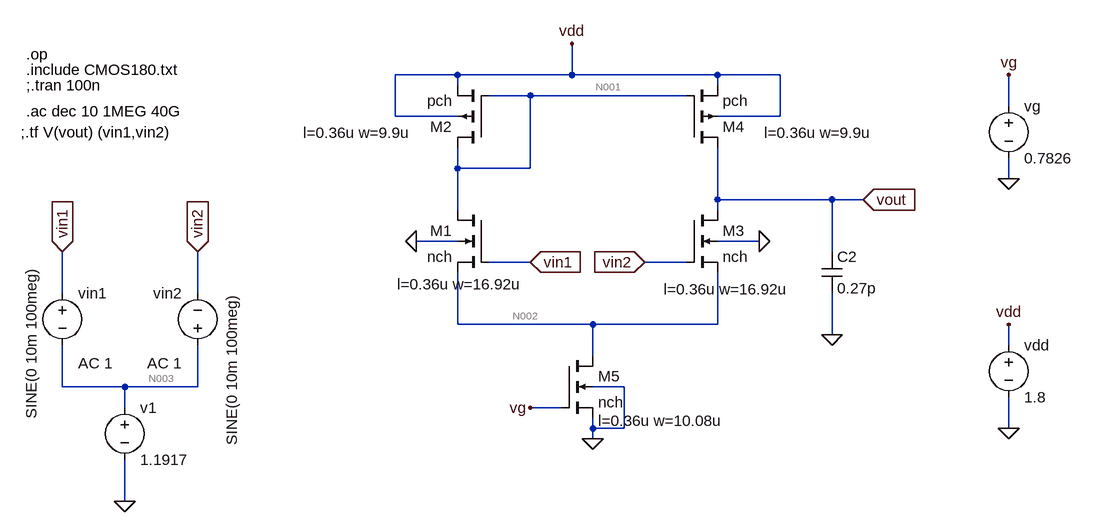
[diagram p0: schematic single stage opmap.asc]
single stage opmap.asc, the LTspice schematic file:
Version 4
SHEET 1 1088 756
WIRE -16 48 -112 48
WIRE 160 48 160 0
WIRE 160 48 -16 48
WIRE 384 48 160 48
WIRE 480 48 384 48
WIRE -16 64 -16 48
WIRE 384 64 384 48
WIRE 96 80 32 80
WIRE 336 80 96 80
WIRE 832 96 832 48
WIRE -112 112 -112 48
WIRE -16 112 -112 112
WIRE 480 112 480 48
WIRE 480 112 384 112
WIRE -16 192 -16 160
WIRE 96 192 96 80
WIRE 96 192 -16 192
WIRE 832 208 832 176
WIRE 384 240 384 160
WIRE 560 240 384 240
WIRE 608 240 560 240
WIRE -16 256 -16 192
WIRE 384 256 384 240
WIRE -16 304 -80 304
WIRE 448 304 384 304
WIRE 560 320 560 240
WIRE 96 336 32 336
WIRE 336 336 272 336
WIRE -624 384 -624 320
WIRE -416 384 -416 320
WIRE -16 432 -16 352
WIRE 192 432 -16 432
WIRE 384 432 384 352
WIRE 384 432 192 432
WIRE 560 448 560 384
WIRE 832 464 832 432
WIRE 192 480 192 432
WIRE -624 528 -624 464
WIRE -528 528 -624 528
WIRE -416 528 -416 464
WIRE -416 528 -528 528
WIRE 240 528 192 528
WIRE -528 560 -528 528
WIRE 144 560 96 560
WIRE 192 592 192 576
WIRE 240 592 240 528
WIRE 240 592 192 592
WIRE 832 592 832 544
WIRE 192 608 192 592
WIRE -528 704 -528 640
FLAG 160 0 vdd
FLAG 608 240 vout
IOPIN 608 240 In
FLAG 560 448 0
FLAG -528 704 0
FLAG -624 320 vin1
IOPIN -624 320 In
FLAG -416 320 vin2
IOPIN -416 320 In
FLAG 96 336 vin1
IOPIN 96 336 In
FLAG 272 336 vin2
IOPIN 272 336 In
FLAG 832 432 vdd
FLAG 832 592 0
FLAG 448 304 0
FLAG 192 608 0
FLAG 96 560 vg
FLAG 832 208 0
FLAG 832 48 vg
FLAG -80 304 0
DATAFLAG 384 240 ""
SYMBOL nmos4 32 256 M0
WINDOW 123 -52 114 Left 2
SYMATTR Value2 l=0.36u w=16.92u
SYMATTR InstName M1
SYMATTR Value nch
SYMBOL pmos4 32 160 R180
WINDOW 123 120 23 Left 2
SYMATTR Value2 l=0.36u w=9.9u
SYMATTR InstName M2
SYMATTR Value pch
SYMBOL nmos4 336 256 R0
WINDOW 123 -35 122 Left 2
SYMATTR Value2 l=0.36u w=16.92u
SYMATTR InstName M3
SYMATTR Value nch
SYMBOL cap 544 320 R0
SYMATTR InstName C2
SYMATTR Value 0.27p
SYMBOL pmos4 336 160 M180
WINDOW 123 120 23 Left 2
SYMATTR Value2 l=0.36u w=9.9u
SYMATTR InstName M4
SYMATTR Value pch
SYMBOL voltage -528 544 R0
WINDOW 123 0 0 Left 0
WINDOW 39 0 0 Left 0
SYMATTR InstName v1
SYMATTR Value 1.1917
SYMBOL voltage -624 368 R0
WINDOW 3 -48 -25 VRight 2
WINDOW 123 24 124 Left 2
WINDOW 39 0 0 Left 0
SYMATTR Value SINE(0 10m 100meg)
SYMATTR Value2 AC 1
SYMATTR InstName vin1
SYMBOL voltage -416 480 R180
WINDOW 0 24 96 Left 2
WINDOW 3 -53 -138 VRight 2
WINDOW 123 24 -12 Left 2
WINDOW 39 0 0 Left 0
SYMATTR InstName vin2
SYMATTR Value SINE(0 10m 100meg)
SYMATTR Value2 AC 1
SYMBOL voltage 832 448 R0
WINDOW 123 0 0 Left 0
WINDOW 39 0 0 Left 0
SYMATTR InstName vdd
SYMATTR Value 1.8
SYMBOL nmos4 144 480 R0
WINDOW 123 56 100 Left 2
SYMATTR Value2 l=0.36u w=10.08u
SYMATTR InstName M5
SYMATTR Value nch
SYMBOL voltage 832 80 R0
WINDOW 123 0 0 Left 0
WINDOW 39 0 0 Left 0
SYMATTR InstName vg
SYMATTR Value 0.7826
TEXT -680 40 Left 2 !.include CMOS180.txt
TEXT -680 16 Left 2 !.op
TEXT -688 136 Left 2 !;.tf V(vout) (vin1,vin2)
TEXT -680 64 Left 2 !;.tran 100n
TEXT -680 104 Left 2 !.ac dec 10 1MEG 40G

The netlist it stands for:
* single stage opmap.asc
M1 N001 vin1 N002 0 nch l=0.36u w=16.92u
M2 N001 N001 vdd vdd pch l=0.36u w=9.9u
M3 vout vin2 N002 0 nch l=0.36u w=16.92u
C2 vout 0 0.27p
M4 vout N001 vdd vdd pch l=0.36u w=9.9u
v1 N003 0 1.1917
vin1 vin1 N003 SINE(0 10m 100meg) AC 1
vin2 N003 vin2 SINE(0 10m 100meg) AC 1
vdd vdd 0 1.8
M5 N002 vg 0 0 nch l=0.36u w=10.08u
vg vg 0 0.7826
.model NMOS NMOS
.model PMOS PMOS
.lib standard.mos
.include CMOS180.txt
.op
;.tf V(vout) (vin1,vin2)
;.tran 100n
.ac dec 10 1MEG 40G
.backanno
.end

* Results of the author's LTspice run, read from the files saved beside the schematic
* Operating Point, zero values left out:
*   V(n001) = 928.7 mV
*   V(vin1) = 1.192 V
*   V(n002) = 447.5 mV
*   V(vdd) = 1.8 V
*   V(vout) = 928.7 mV
*   V(vin2) = 1.192 V
*   V(n003) = 1.192 V
*   V(vg) = 782.6 mV
*   Id(M4) = -167.6 µA
*   Is(M4) = 167.6 µA
*   Id(M2) = -167.6 µA
*   Is(M2) = 167.6 µA
*   Id(M5) = 335.2 µA
*   Is(M5) = -335.2 µA
*   Id(M3) = 167.6 µA
*   Ib(M3) = -1.396 pA
*   Is(M3) = -167.6 µA
*   Id(M1) = 167.6 µA
*   Ib(M1) = -1.396 pA
*   Is(M1) = -167.6 µA
*   I(Vdd) = -335.2 µA
* From the log:
*   Semiconductor Device Operating Points:
*                           --- BSIM3 MOSFETS ---
*   Name:        m4          m2          m5          m3          m1
*   Model:       pch         pch         nch         nch         nch
*   Id:       -1.68e-04   -1.68e-04    3.35e-04    1.68e-04    1.68e-04
*   Vgs:      -8.71e-01   -8.71e-01    7.83e-01    7.44e-01    7.44e-01
*   Vds:      -8.71e-01   -8.71e-01    4.48e-01    4.81e-01    4.81e-01
*   Vbs:       0.00e+00    0.00e+00    0.00e+00   -4.48e-01   -4.48e-01
*   Vth:      -4.49e-01   -4.49e-01    4.62e-01    5.84e-01    5.84e-01
*   Vdsat:    -3.40e-01   -3.40e-01    2.28e-01    1.41e-01    1.41e-01
*   Gm:        6.93e-04    6.93e-04    1.95e-03    1.97e-03    1.97e-03
*   Gds:       1.80e-05    1.80e-05    5.25e-05    2.95e-05    2.95e-05
*   Gmb        2.26e-04    2.26e-04    5.05e-04    4.51e-04    4.51e-04
*   Cbd:       0.00e+00    0.00e+00    0.00e+00    0.00e+00    0.00e+00
*   Cbs:       0.00e+00    0.00e+00    0.00e+00    0.00e+00    0.00e+00
*   Cgsov:     6.50e-15    6.50e-15    4.95e-15    8.31e-15    8.31e-15
*   Cgdov:     6.50e-15    6.50e-15    4.95e-15    8.31e-15    8.31e-15
*   Cgbov:     2.98e-19    2.98e-19    3.28e-19    3.28e-19    3.28e-19
*   dQgdVgb:   3.39e-14    3.39e-14    3.35e-14    5.53e-14    5.53e-14
*   dQgdVdb:  -6.50e-15   -6.50e-15   -4.88e-15   -8.11e-15   -8.11e-15
*   dQgdVsb:  -2.65e-14   -2.65e-14   -2.72e-14   -4.48e-14   -4.48e-14
*   dQddVgb:  -6.54e-15   -6.54e-15   -5.13e-15   -8.44e-15   -8.44e-15
*   dQddVdb:   6.53e-15    6.53e-15    5.13e-15    8.38e-15    8.38e-15
*   dQddVsb:   1.72e-17    1.72e-17    4.58e-17    9.39e-17    9.39e-17
*   dQbdVgb:  -4.30e-15   -4.30e-15   -4.99e-15   -7.77e-15   -7.77e-15
*   dQbdVdb:  -7.38e-18   -7.38e-18   -5.01e-17   -8.58e-18   -8.58e-18
*   dQbdVsb:  -1.97e-15   -1.97e-15   -2.04e-15   -2.29e-15   -2.29e-15